# EAGLE design CarrinhoAcel (EAGLE 9.5.1)
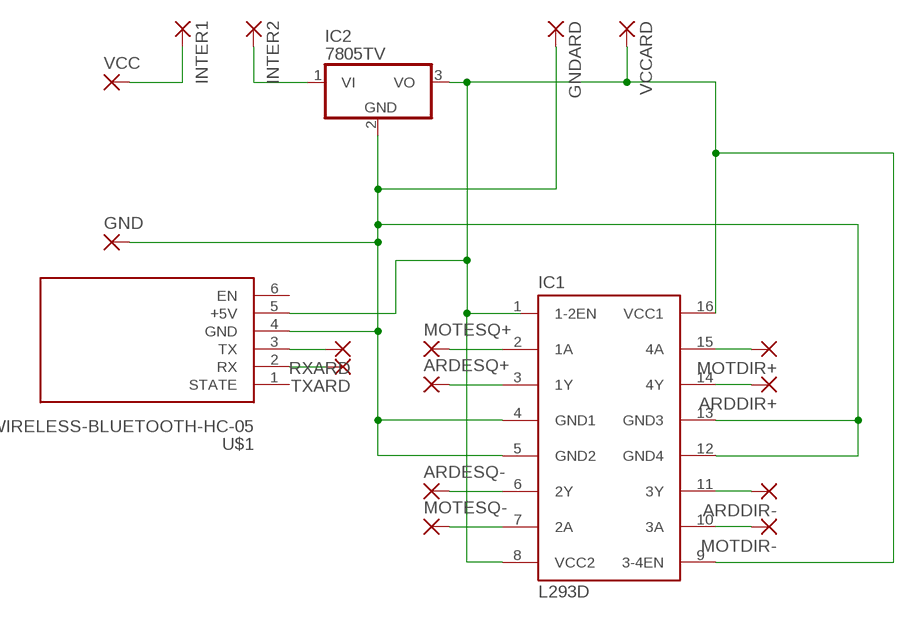
[diagram p0: schematic, sheet 1]

## Parts
ARDDIR+  2,15/1,0  [2,15/1,0]
ARDDIR-  2,15/1,0  [2,15/1,0]
ARDESQ+  2,15/1,0  [2,15/1,0]
ARDESQ-  2,15/1,0  [2,15/1,0]
GND  2,15/1,0  [2,15/1,0]
GNDARD  2,15/1,0  [2,15/1,0]
IC1  L293D  [DIL16]
IC2  7805TV  [TO220V]
INTER1  2,15/1,0  [2,15/1,0]
INTER2  2,15/1,0  [2,15/1,0]
MOTDIR+  2,15/1,0  [2,15/1,0]
MOTDIR-  2,15/1,0  [2,15/1,0]
MOTESQ+  2,15/1,0  [2,15/1,0]
MOTESQ-  2,15/1,0  [2,15/1,0]
RXARD  2,15/1,0  [2,15/1,0]
TXARD  2,15/1,0  [2,15/1,0]
U$1  WIRELESS-BLUETOOTH-HC-05  [WIRELESS-BLUETOOTH-HC-05]
VCC  2,15/1,0  [2,15/1,0]
VCCARD  2,15/1,0  [2,15/1,0]

## Nets
N$1: INTER1.1(P) VCC.1(P)
N$2: GND.1(P) GNDARD.1(P) IC1.4(GND1) IC1.5(GND2) IC1.12(GND4) IC1.13(GND3) IC2.2(GND) U$1.4(GND)
N$3: IC1.2(1A) MOTESQ+.1(P)
N$4: ARDESQ+.1(P) IC1.3(1Y)
N$5: ARDESQ-.1(P) IC1.6(2Y)
N$6: IC1.7(2A) MOTESQ-.1(P)
N$7: IC1.1(1-2EN) IC1.8(VCC2) IC1.9(3-4EN) IC1.16(VCC1) IC2.3(VO) U$1.5(+5V) VCCARD.1(P)
N$8: IC1.10(3A) MOTDIR-.1(P)
N$9: ARDDIR-.1(P) IC1.11(3Y)
N$10: ARDDIR+.1(P) IC1.14(4Y)
N$11: IC1.15(4A) MOTDIR+.1(P)
N$12: RXARD.1(P) U$1.3(TX)
N$13: IC2.1(VI) INTER2.1(P)
N$14: TXARD.1(P) U$1.2(RX)
Unconnected: U$1.1(STATE) U$1.6(EN)

## Library data of the parts
ARDDIR+ ARDDIR- ARDESQ+ ARDESQ- GND GNDARD INTER1 INTER2 MOTDIR+ MOTDIR- MOTESQ+ MOTESQ- RXARD TXARD VCC VCCARD = wirepad:2,15/1,0: THROUGH-HOLE PAD
IC1 = st-microelectronics:L293D: PUSH-PULL 4 CHANNEL DRIVER; MPN: L293D; OC_FARNELL: 9589619; OC_NEWARK: 56P8249
IC2 = linear:78*: Positive VOLTAGE REGULATOR Source: http://cache.national.com/ds/LM/LM78L05.pdf http://www.fairchildsemi.com/ds/LM/LM7805.pdf
U$1 = diy-modules:WIRELESS-BLUETOOTH-HC-05: Bluetooth Transceiver Module based on HC-05 board Tutorial is available here: https://arduino-info.wikispaces.com/BlueTooth-HC05-HC06-Modules-How-To Click here to find device on ebay.com <http://www.ebay.com/sch/hc-05+module+rs232>

## Board
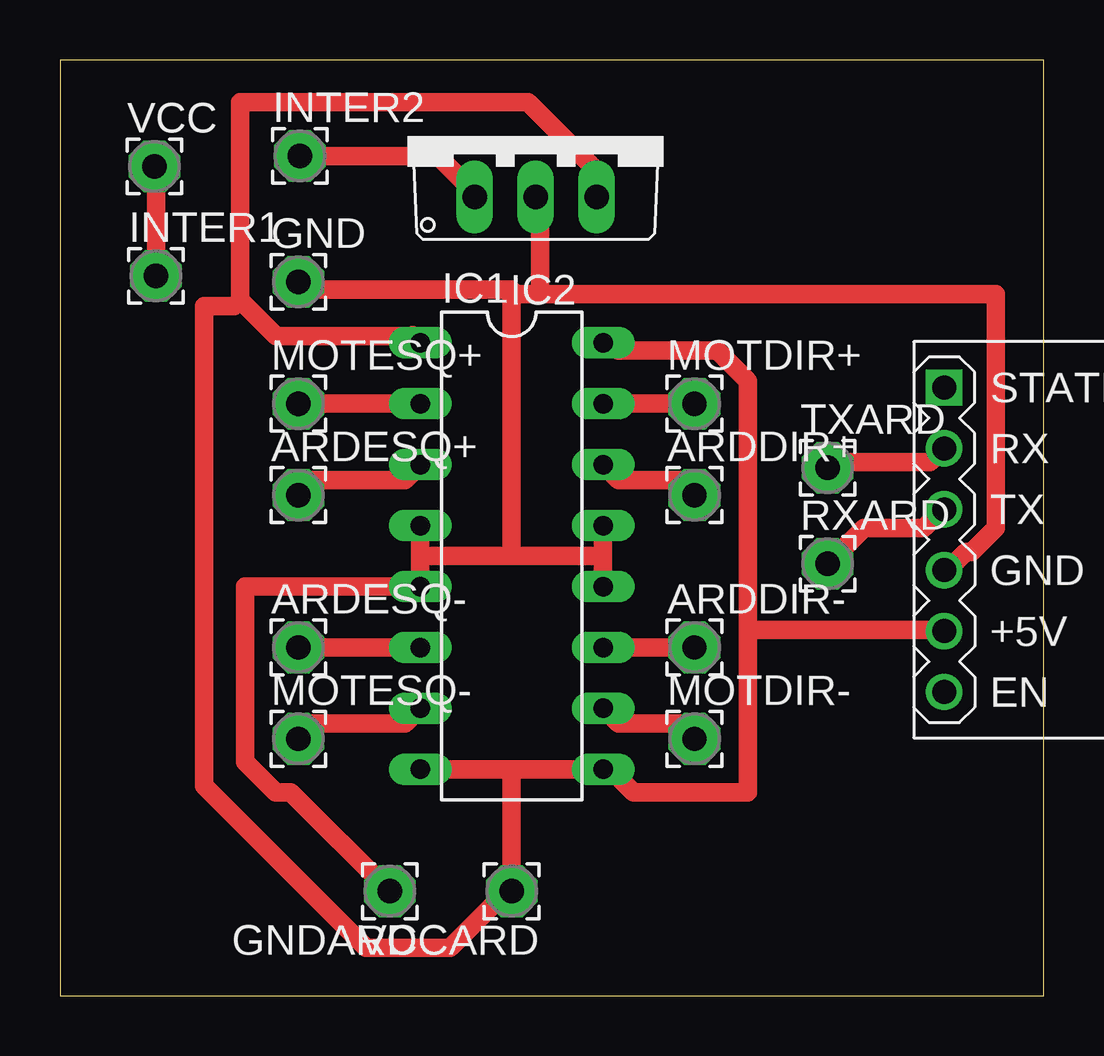
[diagram p1: board, top side]

Size 41 x 39 mm. Coordinates in mm from the lower left corner, seen from the top.
Outline: 0,0 41,0 41,39 0,39 0,0
Copper layers (1*16): Top 0.035mm / dielectric 1.5mm / Bottom 0.035mm
Design rules "default *": minimum track width 30mil, minimum drill 0.35mm, track to track 30mil, track to pad 30mil, pad to pad 30mil, via to via 30mil, smd to smd 30mil, copper to edge 40mil, drill to drill 6mil, minimum pad ring 10mil, minimum via ring 8mil, stop-mask expansion 4mil, vias tented up to drill 0mil, thermal gap 10mil

### Footprints (pad centres in the part's own frame; a part is rotated, then mirrored left to right if it is on the bottom)
2,15/1,0 = drill 1.016 pad 2.159 octagon: 1 0,0
DIL16 = drill 0.813 long: 1 -8.89,-3.81; 2 -6.35,-3.81; 3 -3.81,-3.81; 4 -1.27,-3.81; 5 1.27,-3.81; 6 3.81,-3.81; 7 6.35,-3.81; 8 8.89,-3.81; 9 8.89,3.81; 10 6.35,3.81; 11 3.81,3.81; 12 1.27,3.81; 13 -1.27,3.81; 14 -3.81,3.81; 15 -6.35,3.81; 16 -8.89,3.81
TO220V = drill 1.016 long: 1 -2.54,-2.54; 2 0,-2.54; 3 2.54,-2.54
WIRELESS-BLUETOOTH-HC-05 = drill 1 square: 1 -6.35,-17.145 | drill 1: 2 -3.81,-17.145; 3 -1.27,-17.145; 4 1.27,-17.145; 5 3.81,-17.145; 6 6.35,-17.145

### Placement (x,y rotation side)
ARDDIR+  26.45,20.86 0 top
ARDDIR-  26.45,14.51 0 top
ARDESQ+  9.94,20.86 0 top
ARDESQ-  9.94,14.51 0 top
GND  9.94,29.75 0 top
GNDARD  13.75,4.35 180 top
IC1  18.83,18.32 270 top
IC2  19.83,35.83 0 top
INTER1  4,30 0 top
INTER2  10,35 0 top
MOTDIR+  26.45,24.67 0 top
MOTDIR-  26.45,10.7 0 top
MOTESQ+  9.94,24.67 0 top
MOTESQ-  9.94,10.7 0 top
RXARD  32,18 0 top
TXARD  32,22 0 top
U$1  54,19 270 top
VCC  3.94,34.56 0 top
VCCARD  18.83,4.35 180 top

### Tracks (layer width: path | path; a pad name or v marks a point on that pad's centre or on a via)
N$1
  Top 0.762: INTER1.1 4,34.5 VCC.1
N$2
  Top 0.762: IC1.4 15.02,18.32 | 15.02,18.32 IC1.5 7.72,17.05 7.72,9.75 8.99,8.48 9.62,8.48 GNDARD.1 | IC1.13 22.64,18.32 | 22.64,18.32 IC1.12 | 22.64,18.32 18.83,18.32 | 18.83,18.32 15.02,18.32 | GND.1 10.26,29.43 18.83,29.43 18.83,29.25 | 18.83,29.25 18.83,18.32 | 18.83,29.25 20,29.25 | 20,29.25 39,29.25 39,19.5 38,18.5 37.75,18.5 37,17.75 U$1.4 | 20,29.25 20,33.25 IC2.2
N$3
  Top 0.762: MOTESQ+.1 IC1.2
N$4
  Top 0.762: IC1.3 14.38,21.5 10.57,21.5 ARDESQ+.1
N$5
  Top 0.762: ARDESQ-.1 IC1.6
N$6
  Top 0.762: IC1.7 14.38,11.34 10.57,11.34 MOTESQ-.1
N$7
  Top 0.762: 18.83,9.43 IC1.9 22.96,9.43 23.91,8.48 28.67,8.48 28.67,15.25 | 18.83,9.43 IC1.8 | 28.67,15.25 28.67,25.62 27.4,26.89 23.27,26.89 22.96,27.21 IC1.16 | 14.7,27.53 IC1.1 14.5,27.5 9,27.5 7.5,29 | 18.83,9.43 VCCARD.1 18.5,4.25 16.25,2 12.75,2 6,8.75 6,28.75 7.25,28.75 7.5,29 | 28.67,15.25 36.75,15.25 U$1.5 | 7.5,29 7.5,37.25 19.5,37.25 22.25,34.5 22.25,33.5 IC2.3
N$8
  Top 0.762: IC1.10 23.27,11.34 25.82,11.34 MOTDIR-.1
N$9
  Top 0.762: ARDDIR-.1 IC1.11
N$10
  Top 0.762: IC1.14 23.27,21.5 25.82,21.5 ARDDIR+.1
N$11
  Top 0.762: MOTDIR+.1 IC1.15
N$12
  Top 0.762: RXARD.1 33.5,19.5 36,19.5 36.75,20.25 U$1.3
N$13
  Top 0.762: INTER2.1 15.75,35 17.25,33.5 IC2.1
N$14
  Top 0.762: TXARD.1 32.25,22.25 36.25,22.25 36.75,22.75 U$1.2